# EAGLE schematic Excercise_000_Completed (EAGLE 8.2.1)
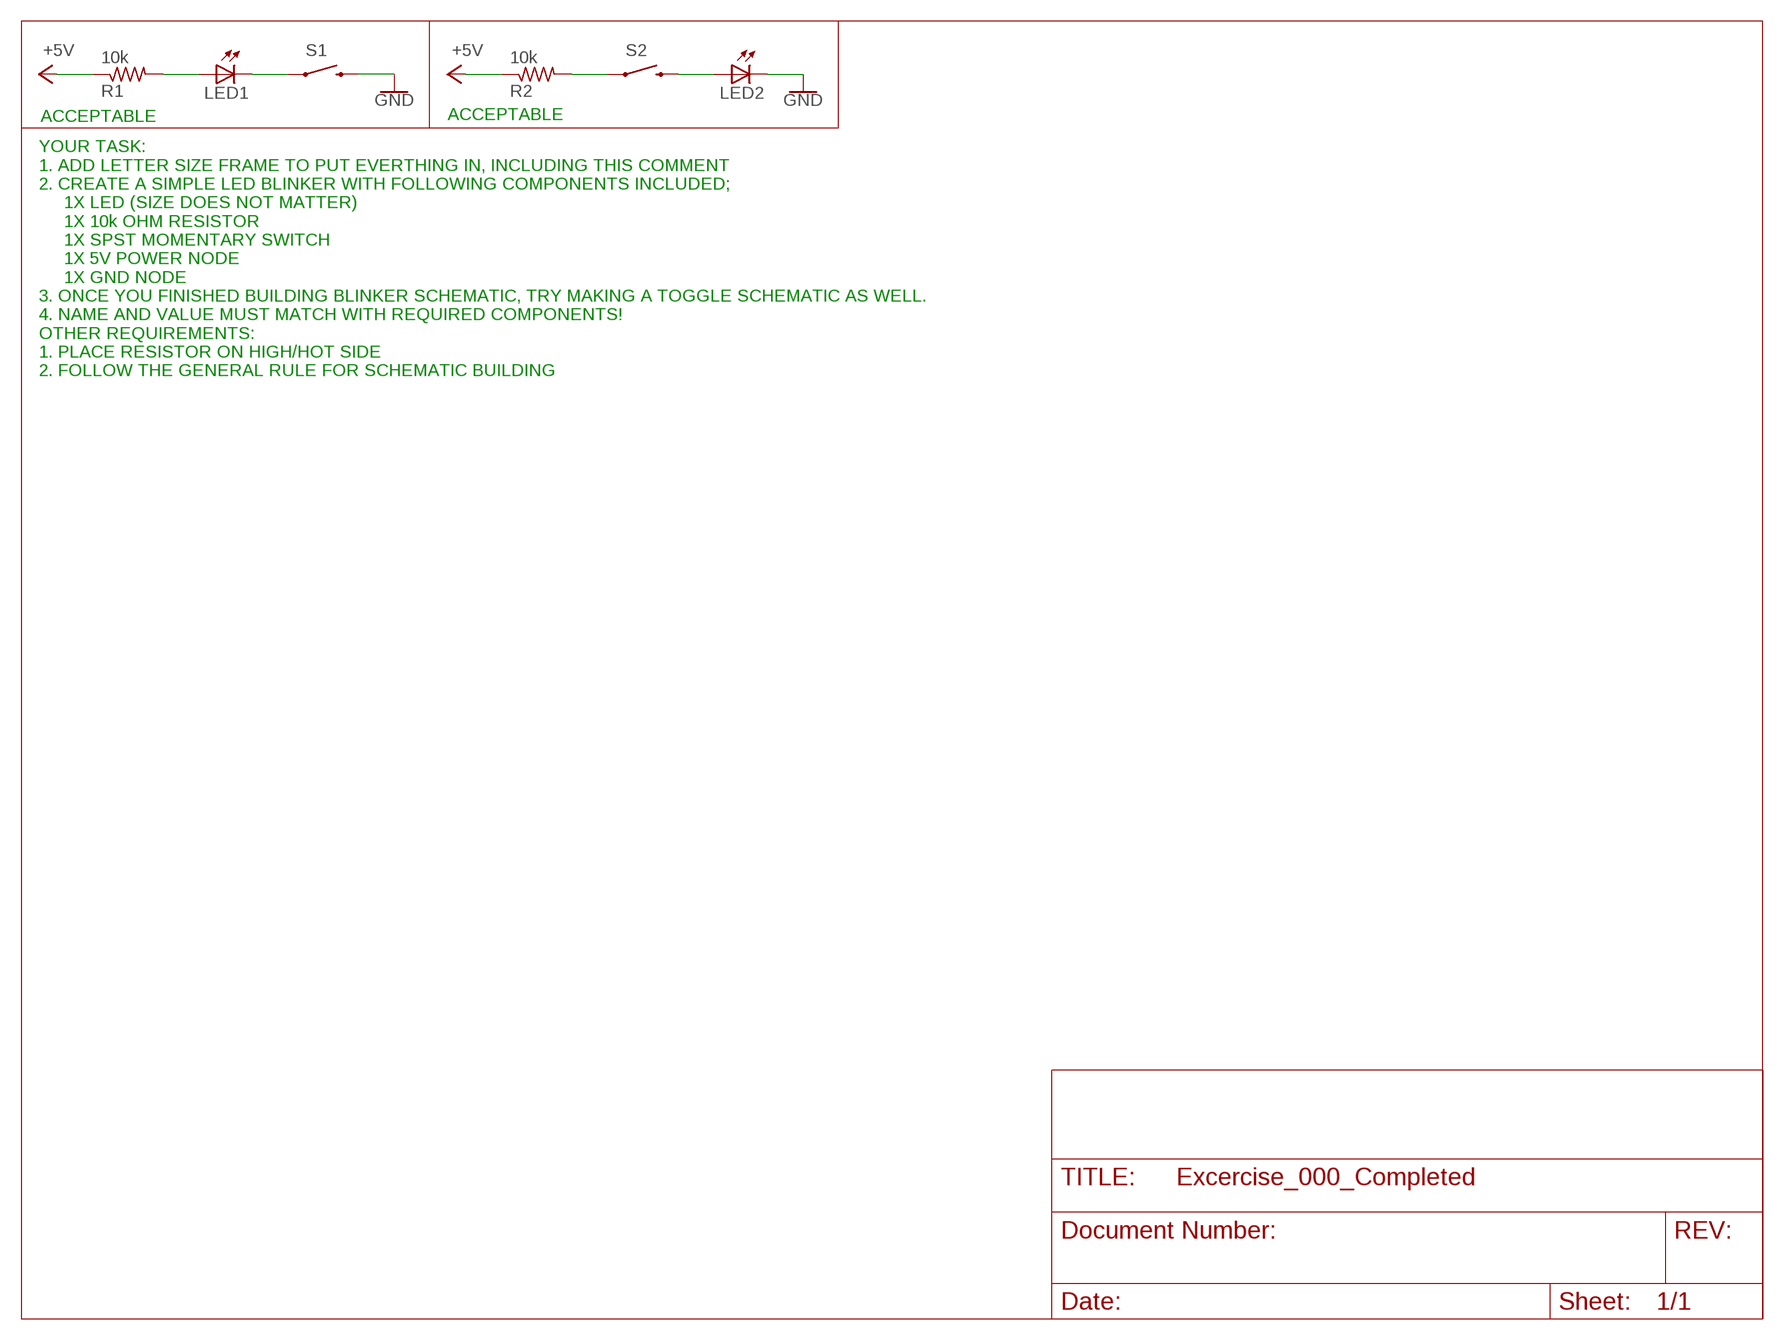
[diagram p0: schematic, sheet 1]

## Parts
LED1  LED5MM  [LED5MM]
LED2  LED5MM  [LED5MM]
R1  10k  R-US_R0805  [R0805]
R2  10k  R-US_R0805  [R0805]
S1  SWITCH-MOMENTARY-SPSTSMD-3  [TACTILE_SWITCH_SMD-3]
S2  SWITCH-MOMENTARY-SPSTSMD-3  [TACTILE_SWITCH_SMD-3]

## Nets
+5V: R1.1 R2.1
GND: LED2.K(C) S1.4
N$1: LED1.A R1.2
N$2: LED1.K(C) S1.1
N$3: R2.2 S2.1
N$4: LED2.A S2.4

## Notes on the sheet
- ACCEPTABLE | ACCEPTABLE
- YOUR TASK:
  1. ADD LETTER SIZE FRAME TO PUT EVERTHING IN, INCLUDING THIS COMMENT
  2. CREATE A SIMPLE LED BLINKER WITH FOLLOWING COMPONENTS INCLUDED;
       1X LED (SIZE DOES NOT MATTER)
       1X 10k OHM RESISTOR
       1X SPST MOMENTARY SWITCH
       1X 5V POWER NODE
       1X GND NODE
  3. ONCE YOU FINISHED BUILDING BLINKER SCHEMATIC, TRY MAKING A TOGGLE SCHEMATIC AS WELL.
  4. NAME AND VALUE MUST MATCH WITH REQUIRED COMPONENTS!
  OTHER REQUIREMENTS:
  1. PLACE RESISTOR ON HIGH/HOT SIDE
  2. FOLLOW THE GENERAL RULE FOR SCHEMATIC BUILDING

## Library data of the parts
LED1 LED2 = adafruit:LED: LED OSRAM: - CHIPLED LG R971, LG N971, LY N971, LG Q971, LY Q971, LO R971, LY R971 LH N974, LH R974 LS Q976, LO Q976, LY Q976 LO Q996 - Hyper CHIPLED LW Q18S LB Q993, LB Q99A, LB R99A - SideLED LS A670, LO A670, LY A670, LG A670, LP A670 LB A673, LV A673, LT A673, LW A673 LH A674 LY A675 LS A676, LA A676, LO A676, LY A676, LW A676 LS A679, LY A679, LG A679 - Hyper Micro SIDELED® LS Y876, LA Y876, LO Y876, LY Y876 LT Y87S - SmartLED LW L88C, LW L88S LB L89C, LB L89S, LG L890 LS L89K, LO L89K, LY L89K LS L896, LA L896, LO L896, LY L896 - TOPLED LS T670, LO T670, LY T670, LG T670, LP T670 LSG T670, LSP T670, LSY T670, LOP T670, LYG T670 LG T671, LOG T671, LSG T671 LB T673, LV T673, LT T673, LW T673 LH T674 LS T676, LA T676, LO T676, LY T676, LB T676, LH T676, LSB T676, LW T676 LB T67C, LV T67C, LT T67C, LS T67K, LO T67K, LY T67K, LW E67C LS E67B, LA E67B, LO E67B, LY E67B, LB E67C, LV E67C, LT E67C LW T67C LS T679, LY T679, LG T679 LS T770, LO T770, LY T770, LG T770, LP T770 LB T773, LV T773, LT T773, LW T773 LH T774 LS E675, LA E675, LY E675, LS T675 LS T776, LA T776, LO T776, LY T776, LB T776 LHGB T686 LT T68C, LB T68C - Hyper Mini TOPLED® LB M676 - Mini TOPLED Santana® LG M470 LS M47K, LO M47K, LY M47K Source: http://www.osram.convergy.de/
R1 R2 = adafruit:R-US_: RESISTOR, American symbol
S1 S2 = SparkFun-Retired:SWITCH-MOMENTARY-SPST: Various NO switches- pushbuttons, reed, etc